# Altium schematic sheet Sheet2.SchDoc
size A4
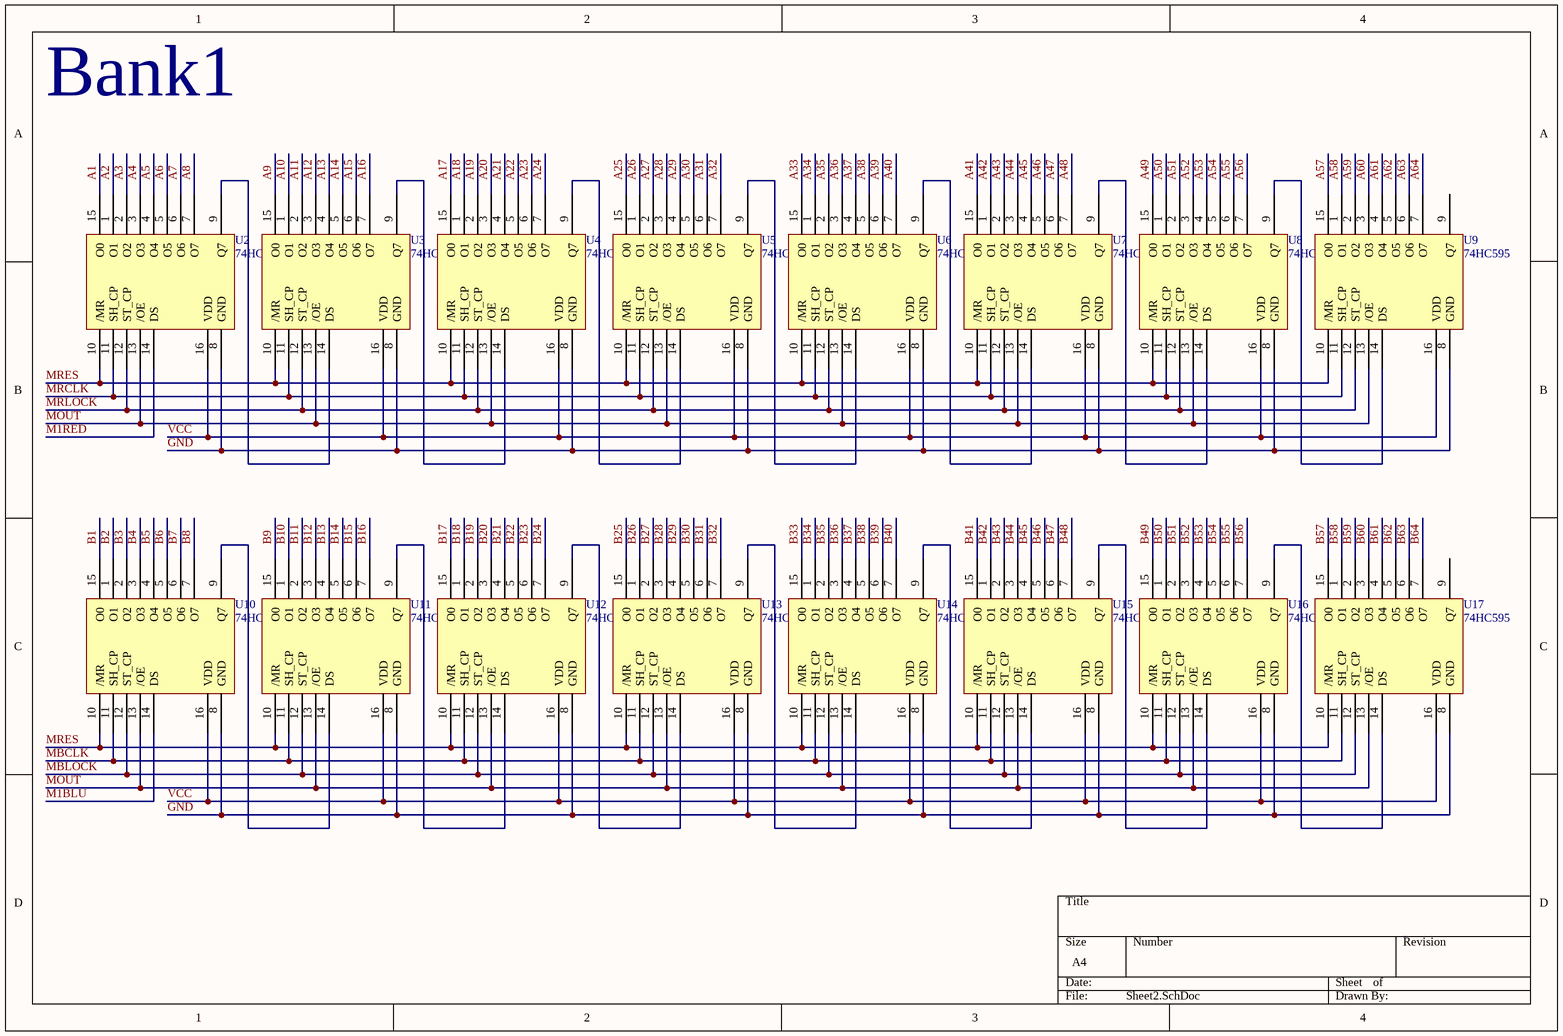
[diagram p0: Sheet2.SchDoc]

## Parts
U2  74HC595
U3  74HC595
U4  74HC595
U5  74HC595
U6  74HC595
U7  74HC595
U8  74HC595
U9  74HC595
U10  74HC595
U11  74HC595
U12  74HC595
U13  74HC595
U14  74HC595
U15  74HC595
U16  74HC595
U17  74HC595

## Nets
A1: U2.15(O0)
A2: U2.1(O1)
A3: U2.2(O2)
A4: U2.3(O3)
A5: U2.4(O4)
A6: U2.5(O5)
A7: U2.6(O6)
A8: U2.7(O7)
A9: U3.15(O0)
A10: U3.1(O1)
A11: U3.2(O2)
A12: U3.3(O3)
A13: U3.4(O4)
A14: U3.5(O5)
A15: U3.6(O6)
A16: U3.7(O7)
A17: U4.15(O0)
A18: U4.1(O1)
A19: U4.2(O2)
A20: U4.3(O3)
A21: U4.4(O4)
A22: U4.5(O5)
A23: U4.6(O6)
A24: U4.7(O7)
A25: U5.15(O0)
A26: U5.1(O1)
A27: U5.2(O2)
A28: U5.3(O3)
A29: U5.4(O4)
A30: U5.5(O5)
A31: U5.6(O6)
A32: U5.7(O7)
A33: U6.15(O0)
A34: U6.1(O1)
A35: U6.2(O2)
A36: U6.3(O3)
A37: U6.4(O4)
A38: U6.5(O5)
A39: U6.6(O6)
A40: U6.7(O7)
A41: U7.15(O0)
A42: U7.1(O1)
A43: U7.2(O2)
A44: U7.3(O3)
A45: U7.4(O4)
A46: U7.5(O5)
A47: U7.6(O6)
A48: U7.7(O7)
A49: U8.15(O0)
A50: U8.1(O1)
A51: U8.2(O2)
A52: U8.3(O3)
A53: U8.4(O4)
A54: U8.5(O5)
A55: U8.6(O6)
A56: U8.7(O7)
A57: U9.15(O0)
A58: U9.1(O1)
A59: U9.2(O2)
A60: U9.3(O3)
A61: U9.4(O4)
A62: U9.5(O5)
A63: U9.6(O6)
A64: U9.7(O7)
B1: U10.15(O0)
B2: U10.1(O1)
B3: U10.2(O2)
B4: U10.3(O3)
B5: U10.4(O4)
B6: U10.5(O5)
B7: U10.6(O6)
B8: U10.7(O7)
B9: U11.15(O0)
B10: U11.1(O1)
B11: U11.2(O2)
B12: U11.3(O3)
B13: U11.4(O4)
B14: U11.5(O5)
B15: U11.6(O6)
B16: U11.7(O7)
B17: U12.15(O0)
B18: U12.1(O1)
B19: U12.2(O2)
B20: U12.3(O3)
B21: U12.4(O4)
B22: U12.5(O5)
B23: U12.6(O6)
B24: U12.7(O7)
B25: U13.15(O0)
B26: U13.1(O1)
B27: U13.2(O2)
B28: U13.3(O3)
B29: U13.4(O4)
B30: U13.5(O5)
B31: U13.6(O6)
B32: U13.7(O7)
B33: U14.15(O0)
B34: U14.1(O1)
B35: U14.2(O2)
B36: U14.3(O3)
B37: U14.4(O4)
B38: U14.5(O5)
B39: U14.6(O6)
B40: U14.7(O7)
B41: U15.15(O0)
B42: U15.1(O1)
B43: U15.2(O2)
B44: U15.3(O3)
B45: U15.4(O4)
B46: U15.5(O5)
B47: U15.6(O6)
B48: U15.7(O7)
B49: U16.15(O0)
B50: U16.1(O1)
B51: U16.2(O2)
B52: U16.3(O3)
B53: U16.4(O4)
B54: U16.5(O5)
B55: U16.6(O6)
B56: U16.7(O7)
B57: U17.15(O0)
B58: U17.1(O1)
B59: U17.2(O2)
B60: U17.3(O3)
B61: U17.4(O4)
B62: U17.5(O5)
B63: U17.6(O6)
B64: U17.7(O7)
GND: U2.8(GND) U3.8(GND) U4.8(GND) U5.8(GND) U6.8(GND) U7.8(GND) U8.8(GND) U9.8(GND) U10.8(GND) U11.8(GND) U12.8(GND) U13.8(GND) U14.8(GND) U15.8(GND) U16.8(GND) U17.8(GND)
M1BLU: U10.14(DS)
M1RED: U2.14(DS)
MBCLK: U10.11(SH_CP) U11.11(SH_CP) U12.11(SH_CP) U13.11(SH_CP) U14.11(SH_CP) U15.11(SH_CP) U16.11(SH_CP) U17.11(SH_CP)
MBLOCK: U10.12(ST_CP) U11.12(ST_CP) U12.12(ST_CP) U13.12(ST_CP) U14.12(ST_CP) U15.12(ST_CP) U16.12(ST_CP) U17.12(ST_CP)
MOUT: U2.13(/OE) U3.13(/OE) U4.13(/OE) U5.13(/OE) U6.13(/OE) U7.13(/OE) U8.13(/OE) U9.13(/OE) U10.13(/OE) U11.13(/OE) U12.13(/OE) U13.13(/OE) U14.13(/OE) U15.13(/OE) U16.13(/OE) U17.13(/OE)
MRCLK: U2.11(SH_CP) U3.11(SH_CP) U4.11(SH_CP) U5.11(SH_CP) U6.11(SH_CP) U7.11(SH_CP) U8.11(SH_CP) U9.11(SH_CP)
MRES: U2.10(/MR) U3.10(/MR) U4.10(/MR) U5.10(/MR) U6.10(/MR) U7.10(/MR) U8.10(/MR) U9.10(/MR) U10.10(/MR) U11.10(/MR) U12.10(/MR) U13.10(/MR) U14.10(/MR) U15.10(/MR) U16.10(/MR) U17.10(/MR)
MRLOCK: U2.12(ST_CP) U3.12(ST_CP) U4.12(ST_CP) U5.12(ST_CP) U6.12(ST_CP) U7.12(ST_CP) U8.12(ST_CP) U9.12(ST_CP)
VCC: U2.16(VDD) U3.16(VDD) U4.16(VDD) U5.16(VDD) U6.16(VDD) U7.16(VDD) U8.16(VDD) U9.16(VDD) U10.16(VDD) U11.16(VDD) U12.16(VDD) U13.16(VDD) U14.16(VDD) U15.16(VDD) U16.16(VDD) U17.16(VDD)
NetU2_9: U2.9(Q7) U3.14(DS)
NetU3_9: U3.9(Q7) U4.14(DS)
NetU4_9: U4.9(Q7) U5.14(DS)
NetU5_9: U5.9(Q7) U6.14(DS)
NetU6_9: U6.9(Q7) U7.14(DS)
NetU7_9: U7.9(Q7) U8.14(DS)
NetU8_9: U8.9(Q7) U9.14(DS)
NetU10_9: U10.9(Q7) U11.14(DS)
NetU11_9: U11.9(Q7) U12.14(DS)
NetU12_9: U12.9(Q7) U13.14(DS)
NetU13_9: U13.9(Q7) U14.14(DS)
NetU14_9: U14.9(Q7) U15.14(DS)
NetU15_9: U15.9(Q7) U16.14(DS)
NetU16_9: U16.9(Q7) U17.14(DS)

Not connected (* = marked no-connect by the designer): U9 9(Q7); U17 9(Q7)

## Notes on the sheet
- Bank1